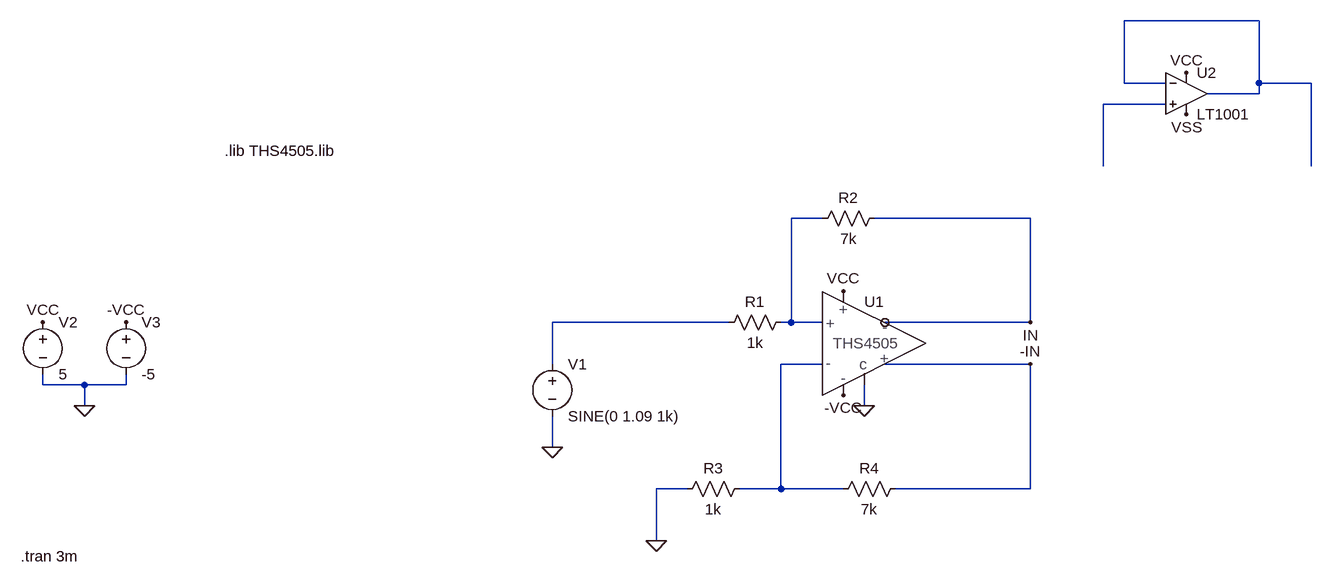
[diagram p0: schematic projet3.asc]
projet3.asc, the LTspice schematic file:
Version 4
SHEET 1 880 680
WIRE 784 -304 576 -304
WIRE 576 -208 576 -304
WIRE 640 -208 576 -208
WIRE 784 -208 784 -304
WIRE 864 -208 784 -208
WIRE 784 -192 784 -208
WIRE 784 -192 704 -192
WIRE 640 -176 544 -176
WIRE 544 -80 544 -176
WIRE 864 -80 864 -208
WIRE 112 0 64 0
WIRE 432 0 192 0
WIRE -32 160 -304 160
WIRE 64 160 64 0
WIRE 64 160 48 160
WIRE 112 160 64 160
WIRE 432 160 432 0
WIRE 432 160 208 160
WIRE -304 224 -304 160
WIRE 112 224 48 224
WIRE 432 224 208 224
WIRE -1088 256 -1088 240
WIRE -1024 256 -1088 256
WIRE -960 256 -960 240
WIRE -960 256 -1024 256
WIRE -1024 288 -1024 256
WIRE 176 288 176 256
WIRE -304 352 -304 304
WIRE -96 416 -144 416
WIRE 48 416 48 224
WIRE 48 416 -16 416
WIRE 144 416 48 416
WIRE 432 416 432 224
WIRE 432 416 224 416
WIRE -144 496 -144 416
FLAG -144 496 0
FLAG -304 352 0
FLAG 176 288 0
FLAG -1024 288 0
FLAG -1088 160 VCC
FLAG -960 160 -VCC
FLAG 144 112 VCC
FLAG 144 272 -VCC
FLAG 432 160 IN
FLAG 432 224 -IN
FLAG 672 -224 VCC
FLAG 672 -160 VSS
SYMBOL THS4505 176 192 R0
SYMATTR InstName U1
SYMBOL res 64 144 R90
WINDOW 0 0 56 VBottom 2
WINDOW 3 32 56 VTop 2
SYMATTR InstName R1
SYMATTR Value 1k
SYMBOL res 208 -16 R90
WINDOW 0 0 56 VBottom 2
WINDOW 3 32 56 VTop 2
SYMATTR InstName R2
SYMATTR Value 7k
SYMBOL voltage -304 208 R0
WINDOW 123 0 0 Left 0
WINDOW 39 0 0 Left 0
SYMATTR InstName V1
SYMATTR Value SINE(0 1.09 1k)
SYMBOL res 0 400 R90
WINDOW 0 0 56 VBottom 2
WINDOW 3 32 56 VTop 2
SYMATTR InstName R3
SYMATTR Value 1k
SYMBOL res 240 400 R90
WINDOW 0 0 56 VBottom 2
WINDOW 3 32 56 VTop 2
SYMATTR InstName R4
SYMATTR Value 7k
SYMBOL voltage -1088 144 R0
WINDOW 123 0 0 Left 0
WINDOW 39 0 0 Left 0
SYMATTR InstName V2
SYMATTR Value 5
SYMBOL voltage -960 144 R0
WINDOW 123 0 0 Left 0
WINDOW 39 0 0 Left 0
SYMATTR InstName V3
SYMATTR Value -5
SYMBOL OpAmps\\LT1001 672 -256 R0
SYMATTR InstName U2
TEXT -808 -104 Left 2 !.lib THS4505.lib
TEXT -1122 520 Left 2 !.tran 3m

The netlist it stands for:
* projet3.asc
XU1 N003 N005 VCC -VCC IN -IN 0 THS4505  ; pins in+ in- vs+ vs- out- out+ cm
R1 N003 N004 1k
R2 IN N003 7k
V1 N004 0 SINE(0 1.09 1k)
R3 N005 0 1k
R4 -IN N005 7k
V2 VCC 0 5
V3 -VCC 0 -5
XU2 N002 N001 VCC VSS N001 LT1001  ; pins In+ In- V+ V- OUT
.lib THS4505.lib
.tran 3m
.lib LTC.lib
.backanno
.end